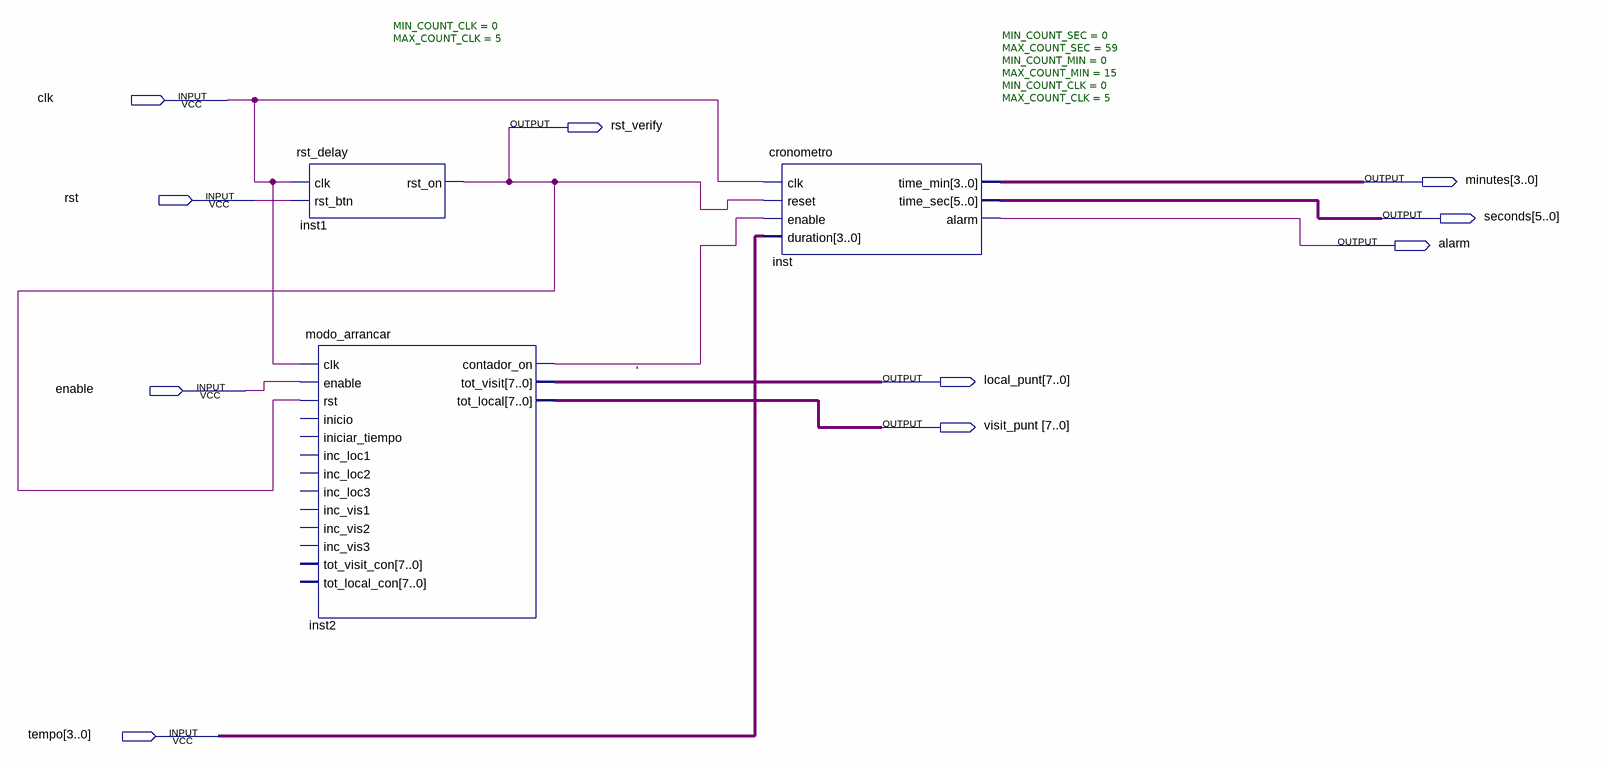
[diagram p0: schematic sheet]
// Quartus schematic MarcadorBaloncesto_main.bdf as structural Verilog: 3 symbols, 10 pins
module MarcadorBaloncesto_main (
  input  clk,
  input  rst,
  input  enable,
  input  [3:0] tempo,
  output rst_verify,
  output [3:0] minutes,
  output [5:0] seconds,
  output alarm,
  output [7:0] local_punt,
  output [7:0] visit_punt
);

  wire \' , inst2_contador_on;

  rst_delay #(.MIN_COUNT_CLK(0), .MAX_COUNT_CLK(5)) inst1 (.clk(clk), .rst_btn(rst), .rst_on(rst_verify));
  modo_arrancar inst2 (
    .clk(clk), .enable(enable), .rst(rst_verify), .contador_on(inst2_contador_on), .tot_visit(\' ),
    .tot_local(visit_punt));  // open: inicio, iniciar_tiempo, inc_loc1, inc_loc2, inc_loc3, inc_vis1, inc_vis2, inc_vis3, tot_visit_con, tot_local_con
  cronometro #(.MIN_COUNT_SEC(0), .MAX_COUNT_SEC(59), .MIN_COUNT_MIN(0), .MAX_COUNT_MIN(15), .MIN_COUNT_CLK(0), .MAX_COUNT_CLK(5)) inst (
    .clk(clk), .reset(rst_verify), .enable(inst2_contador_on), .duration(tempo), .time_min(minutes),
    .time_sec(seconds), .alarm(alarm));
endmodule
